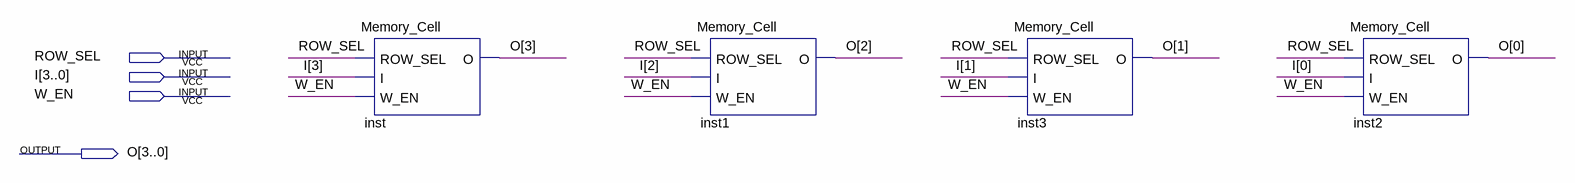
[diagram p0: schematic sheet]
// Quartus schematic MC_4bit.bdf as structural Verilog: 4 symbols, 4 pins
module MC_4bit (
  input  ROW_SEL,
  input  [3:0] I,
  input  W_EN,
  output [3:0] O
);

  Memory_Cell inst (.ROW_SEL(ROW_SEL), .I(I[3]), .W_EN(W_EN), .O(O[3]));
  Memory_Cell inst1 (.ROW_SEL(ROW_SEL), .I(I[2]), .W_EN(W_EN), .O(O[2]));
  Memory_Cell inst3 (.ROW_SEL(ROW_SEL), .I(I[1]), .W_EN(W_EN), .O(O[1]));
  Memory_Cell inst2 (.ROW_SEL(ROW_SEL), .I(I[0]), .W_EN(W_EN), .O(O[0]));
endmodule
